# EAGLE schematic Rev 3 (EAGLE 9.6.2)
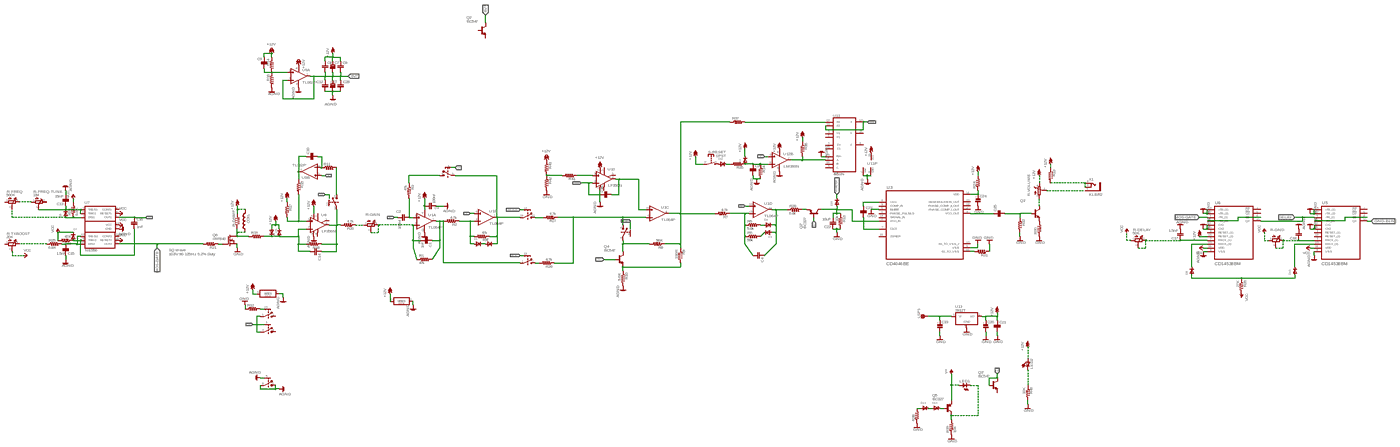
[diagram p0: schematic, sheet 1, overview]
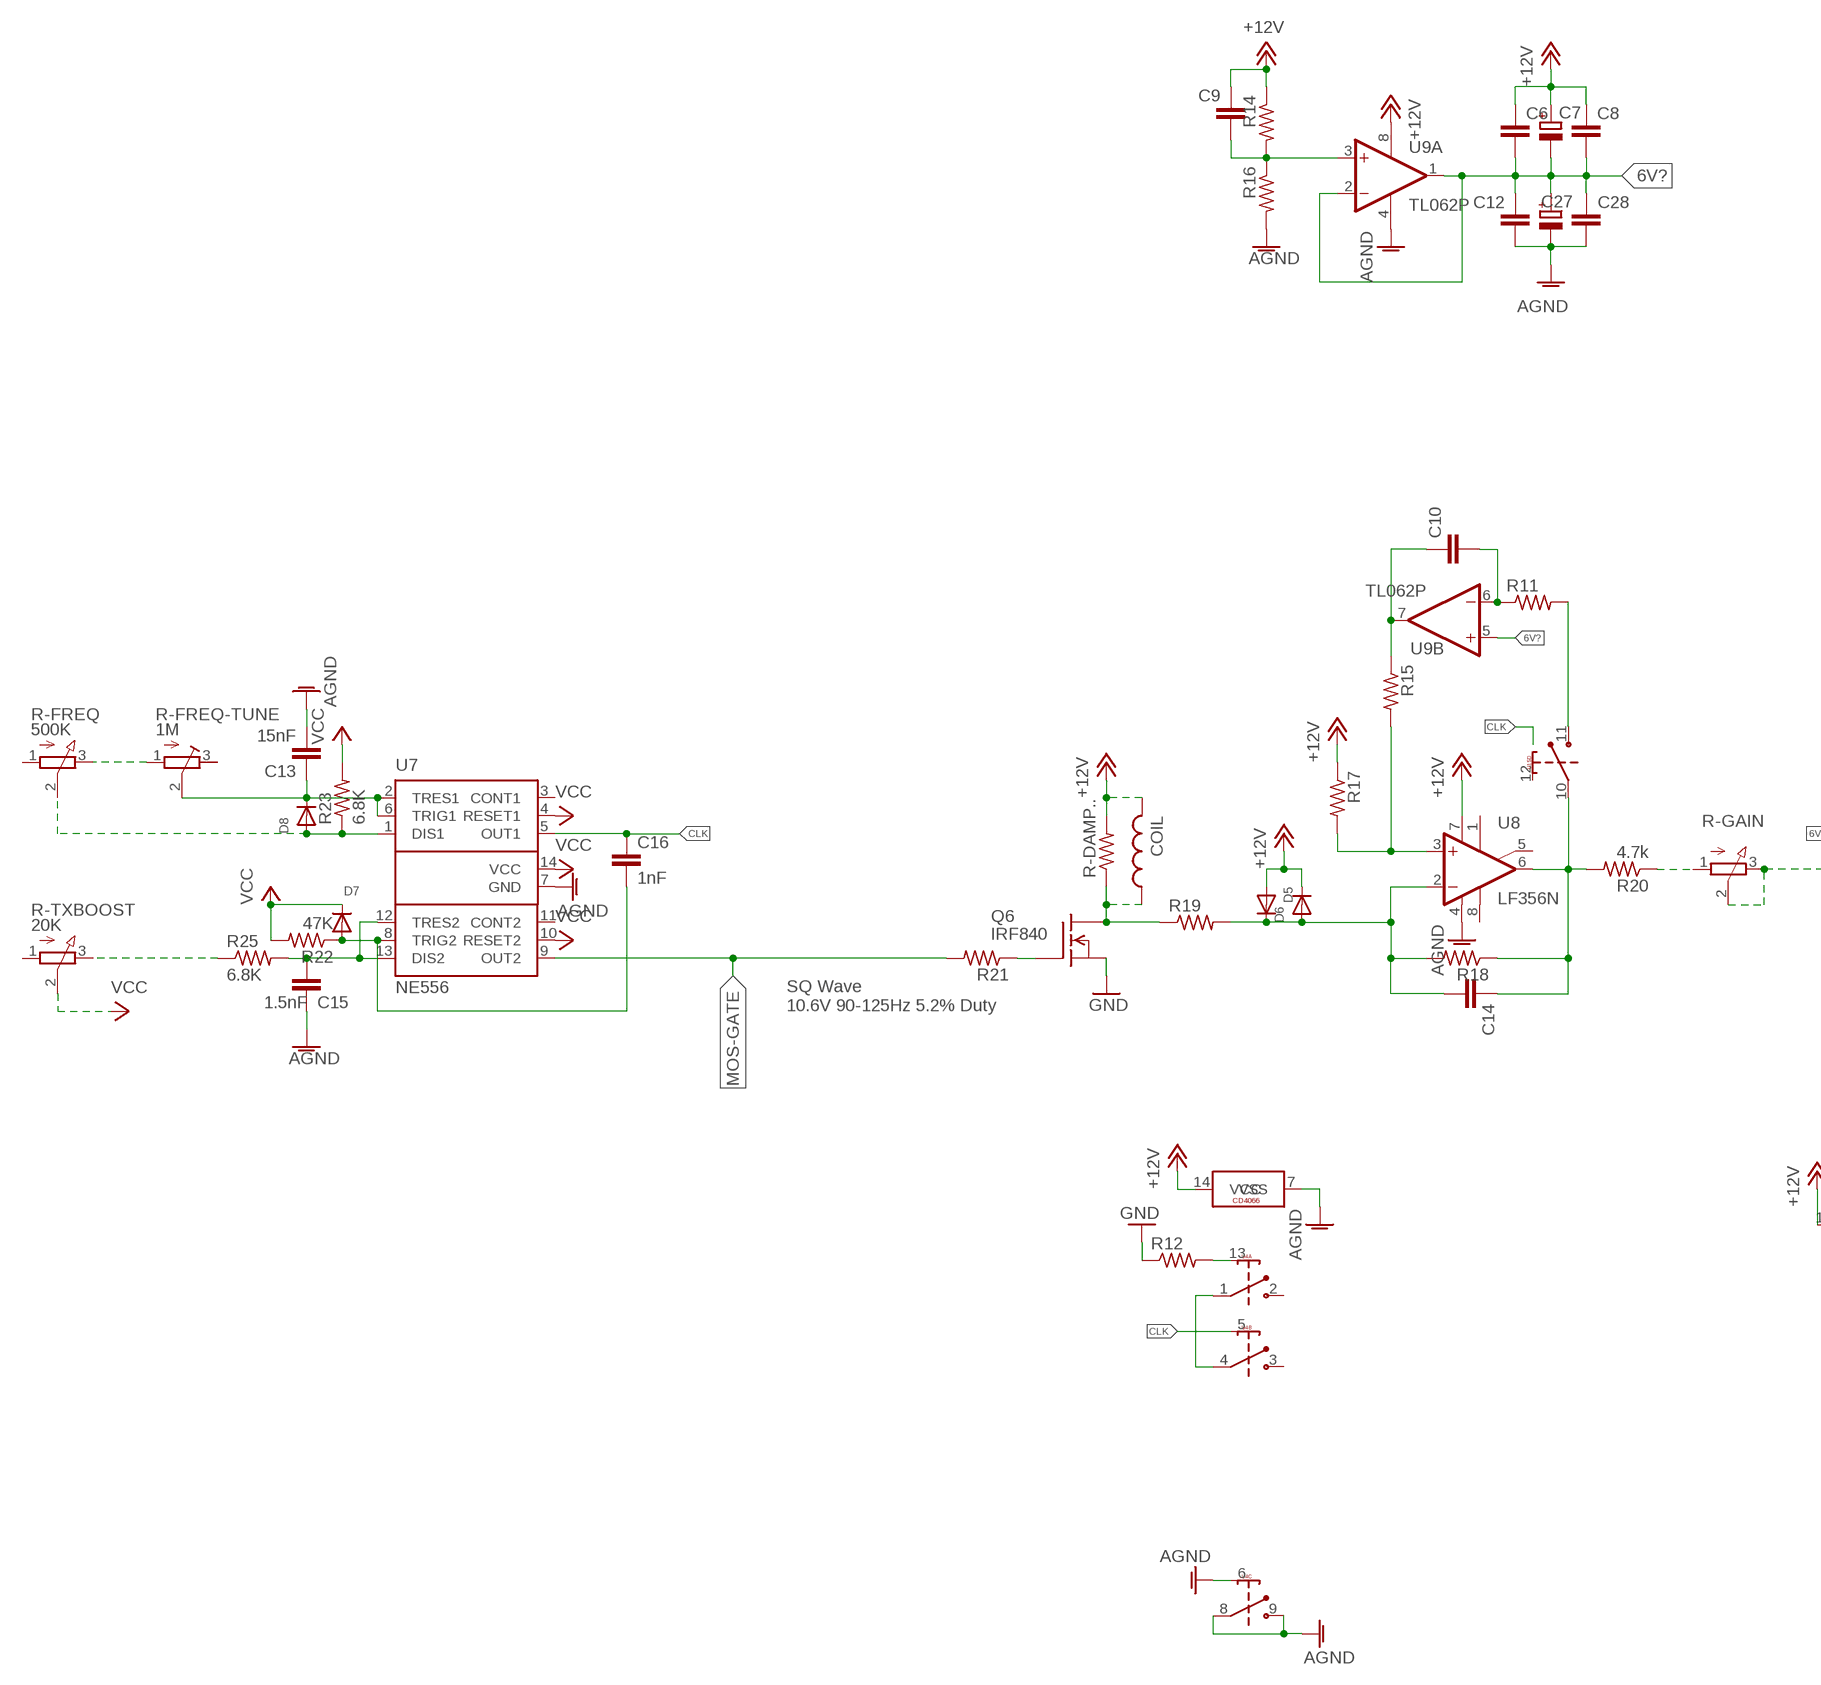
[diagram p1: schematic, sheet 1, part 1 of 4]
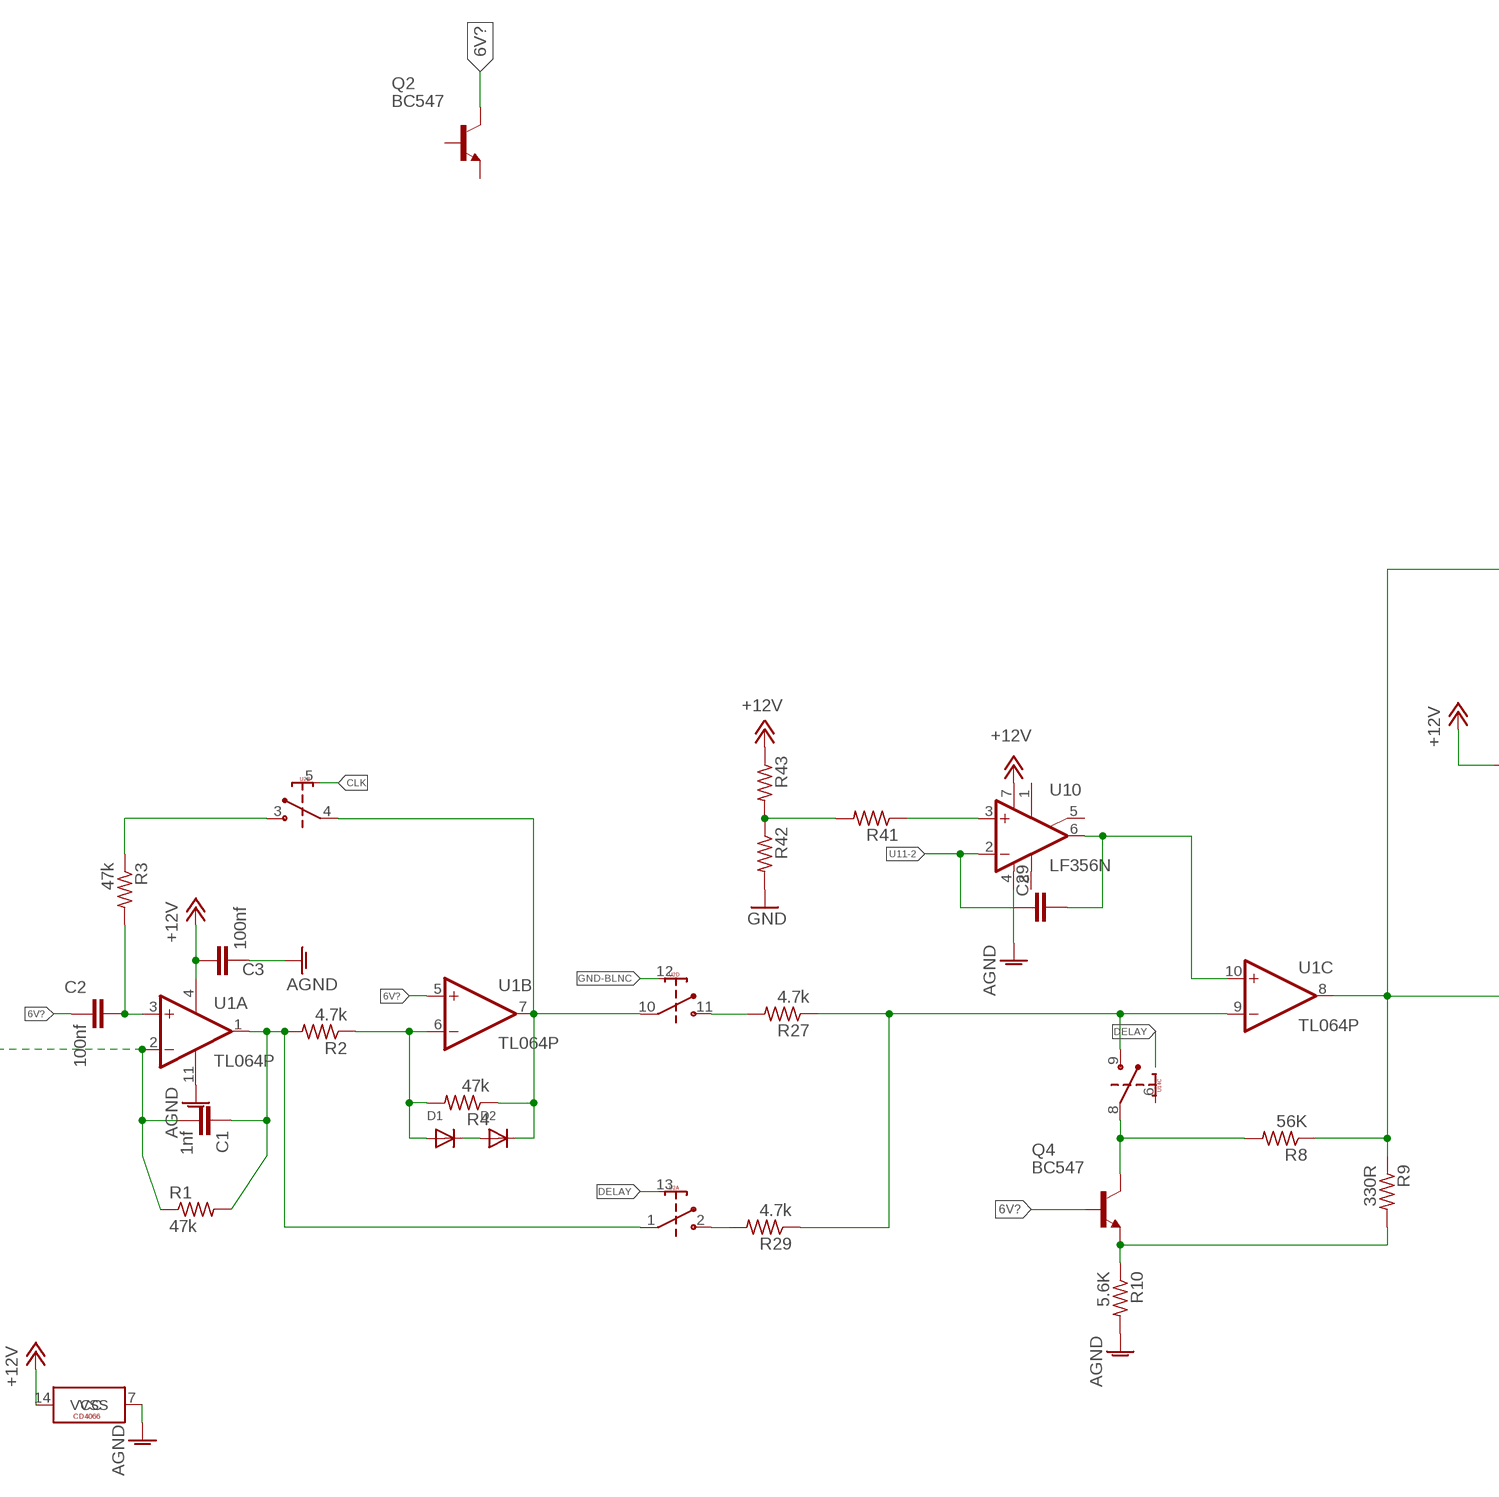
[diagram p2: schematic, sheet 1, part 2 of 4]
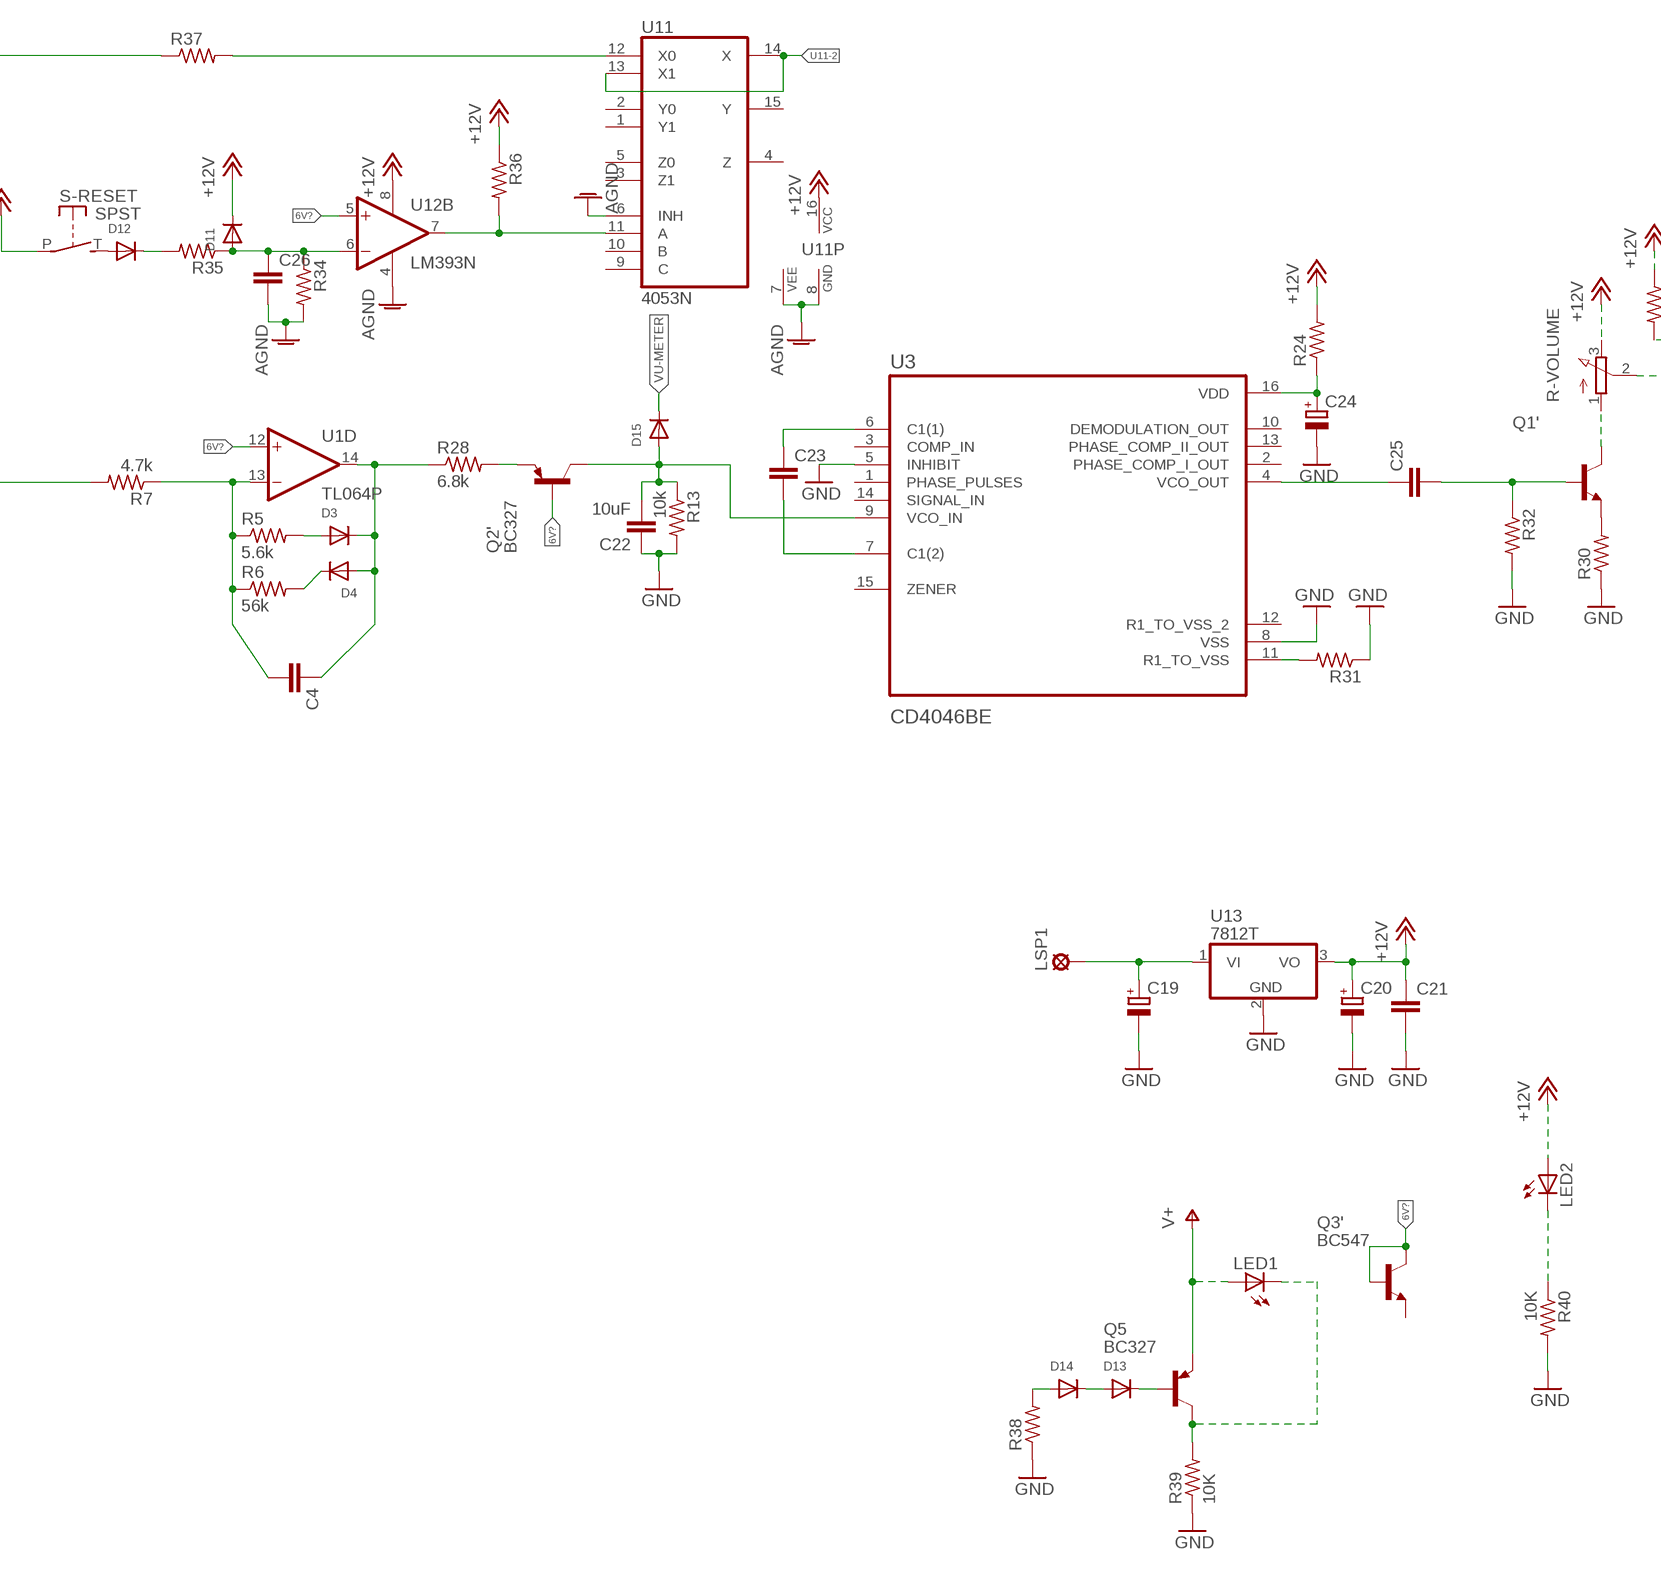
[diagram p3: schematic, sheet 1, part 3 of 4]
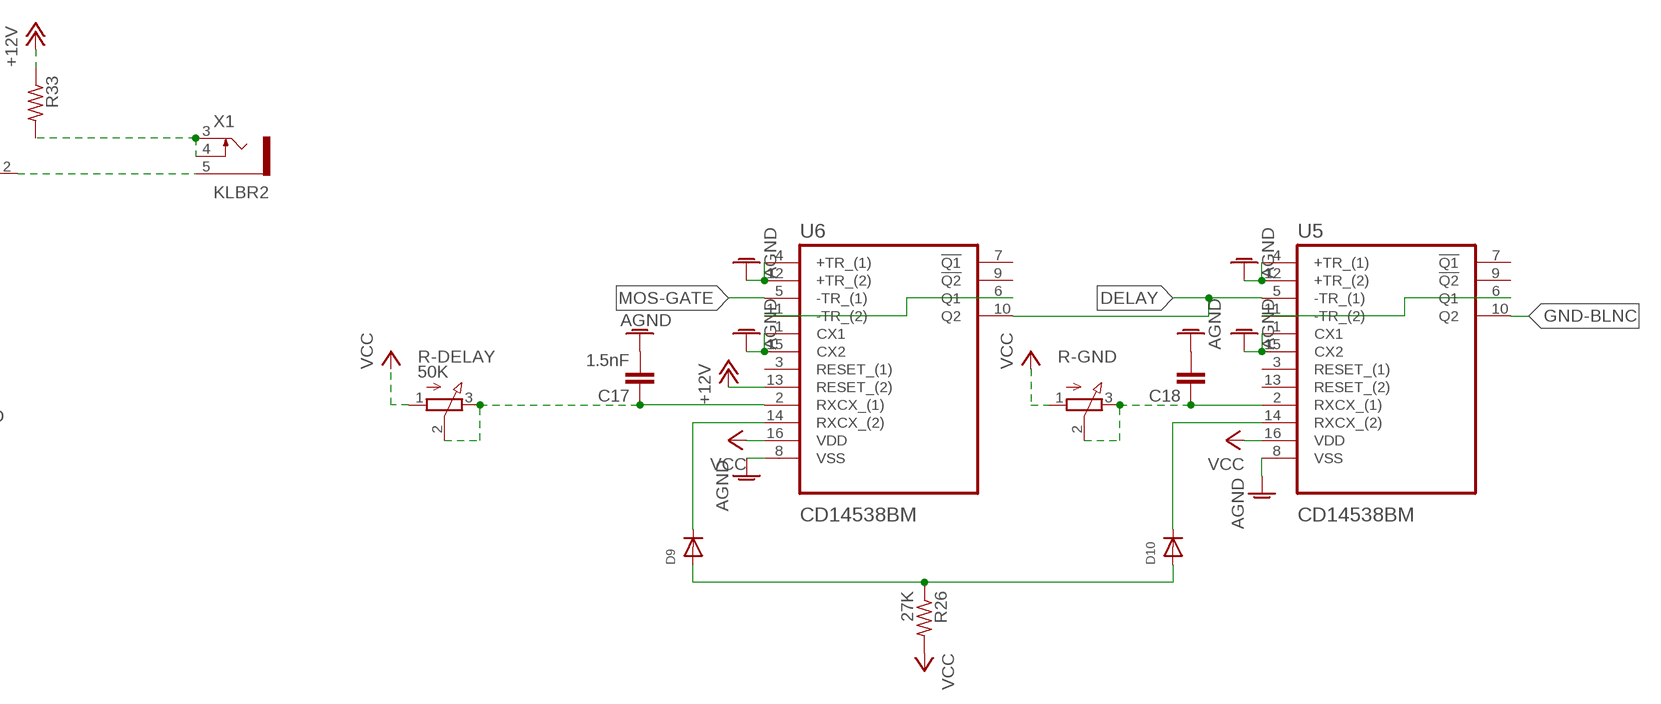
[diagram p4: schematic, sheet 1, part 4 of 4]

## Parts
C1  1nf  C-EU050-025X075  [C050-025X075]
C2  100nf  C-EU050-025X075  [C050-025X075]
C3  100nf  C-EU050-025X075  [C050-025X075]
C4  C-EU050-025X075  [C050-025X075]
C6  C-EU050-025X075  [C050-025X075]
C7  CPOL-EU140CLH-0810  [140CLH-0810]
C8  C-EU050-025X075  [C050-025X075]
C9  C-EU050-025X075  [C050-025X075]
C10  C-EU050-025X075  [C050-025X075]
C12  C-EU050-025X075  [C050-025X075]
C13  15nF  C-EU050-025X075  [C050-025X075]
C14  C-EU050-025X075  [C050-025X075]
C15  1.5nF  C-EU050-025X075  [C050-025X075]
C16  1nF  C-EU050-025X075  [C050-025X075]
C17  1.5nF  C-EU050-025X075  [C050-025X075]
C18  C-EU050-025X075  [C050-025X075]
C19  CPOL-EU140CLH-0810  [140CLH-0810]
C20  CPOL-EU140CLH-0810  [140CLH-0810]
C21  C-EU050-025X075  [C050-025X075]
C22  10uF  C-EU050-025X075  [C050-025X075]
C23  C-EU050-025X075  [C050-025X075]
C24  CPOL-EU140CLH-0810  [140CLH-0810]
C25  C-EU050-025X075  [C050-025X075]
C26  C-EU050-025X075  [C050-025X075]
C27  CPOL-EU140CLH-0810  [140CLH-0810]
C28  C-EU050-025X075  [C050-025X075]
C29  C-EU050-025X075  [C050-025X075]
COIL  L-USTJ4-U2  [TJ4-U2]
D1  DIODEDO-1N4148  [DO-1N4148]
D2  DIODEDO-1N4148  [DO-1N4148]
D3  DIODEDO-1N4148  [DO-1N4148]
D4  DIODEDO-1N4148  [DO-1N4148]
D5  DIODEDO-1N4148  [DO-1N4148]
D6  DIODEDO-1N4148  [DO-1N4148]
D7  DIODEDO-1N4148  [DO-1N4148]
D8  DIODEDO-1N4148  [DO-1N4148]
D9  DIODEDO-1N4148  [DO-1N4148]
D10  DIODEDO-1N4148  [DO-1N4148]
D11  DIODEDO-1N4148  [DO-1N4148]
D12  DIODEDO-1N4148  [DO-1N4148]
D13  DIODEDO-1N4148  [DO-1N4148]
D14  DIODEDO-1N4148  [DO-1N4148]
D15  DIODEDO-1N4148  [DO-1N4148]
LED1  LED5MM  [LED5MM]
LED2  LED5MM  [LED5MM]
LSP1  SE14  [SE14]
Q1'  MPSA14-NPN-TO92-EBC  [TO92-EBC]
Q2  BC547  [TO92]
Q2'  BC327  [TO92]
Q3'  BC547  [TO92]
Q4  BC547  [TO92]
Q5  BC327  [TO92]
Q6  IRF840  [TO220]
R1  47k  R-US_0207/7  [0207/7]
R2  4.7k  R-US_0207/7  [0207/7]
R3  47k  R-US_0207/7  [0207/7]
R4  47k  R-US_0207/7  [0207/7]
R5  5.6k  R-US_0207/7  [0207/7]
R6  56k  R-US_0207/7  [0207/7]
R7  4.7k  R-US_0207/7  [0207/7]
R8  56K  R-US_0207/7  [0207/7]
R9  330R  R-US_0207/7  [0207/7]
R10  5.6K  R-US_0207/7  [0207/7]
R11  R-US_0207/7  [0207/7]
R12  R-US_0207/7  [0207/7]
R13  10k  R-US_0207/7  [0207/7]
R14  R-US_0207/7  [0207/7]
R15  R-US_0207/7  [0207/7]
R16  R-US_0207/7  [0207/7]
R17  R-US_0207/7  [0207/7]
R18  R-US_0207/7  [0207/7]
R19  R-US_0207/7  [0207/7]
R20  4.7k  R-US_0207/7  [0207/7]
R21  R-US_0207/7  [0207/7]
R22  47K  R-US_0207/7  [0207/7]
R23  6.8K  R-US_0207/7  [0207/7]
R24  R-US_0207/7  [0207/7]
R25  6.8K  R-US_0207/7  [0207/7]
R26  27K  R-US_0207/7  [0207/7]
R27  4.7k  R-US_0207/7  [0207/7]
R28  6.8k  R-US_0207/7  [0207/7]
R29  4.7k  R-US_0207/7  [0207/7]
R30  R-US_0207/7  [0207/7]
R31  R-US_0207/7  [0207/7]
R32  R-US_0207/7  [0207/7]
R33  R-US_0207/7  [0207/7]
R34  R-US_0207/7  [0207/7]
R35  R-US_0207/7  [0207/7]
R36  R-US_0207/7  [0207/7]
R37  R-US_0207/7  [0207/7]
R38  R-US_0207/7  [0207/7]
R39  10K  R-US_0207/7  [0207/7]
R40  10K  R-US_0207/7  [0207/7]
R41  R-US_0207/7  [0207/7]
R42  R-US_0207/7  [0207/7]
R43  R-US_0207/7  [0207/7]
R-DAMP..  R-US_0207/7  [0207/7]
R-DELAY  50K  3RP/1610N  [3RP/1610N]
R-FREQ  500K  3RP/1610N  [3RP/1610N]
R-FREQ-TUNE  1M  R-TRIMM3296W  [RTRIM3296W]
R-GAIN  3RP/1610N  [3RP/1610N]
R-GND  3RP/1610N  [3RP/1610N]
R-TXBOOST  20K  3RP/1610N  [3RP/1610N]
R-VOLUME  3RP/1610N  [3RP/1610N]
S-RESET  SPST  [JUDCOSPST]
U1  TL064P  [DIL14]
U2  CD4066B  [DIP254P762X508-14]
U3  CD4046BE  [DIP794W45P254L1969H508Q16]
U4  CD4066B  [DIP254P762X508-14]
U5  CD14538BM  [SOIC127P600X175-16N]
U6  CD14538BM  [SOIC127P600X175-16N]
U7  NE556  [DIL14]
U8  LF356N  [DIL08]
U9  TL062P  [DIL08]
U10  LF356N  [DIL08]
U11  4053N  [DIL16]
U12  LM393N  [DIL08]
U13  7812T  [TO220H]
U14  CD4066B  [DIP254P762X508-14]
U15  CD4066B  [DIP254P762X508-14]
X1  KLBR2  [KLBR2]

## Nets
6V?: C2.2 C6.2 C7.- C8.2 C12.1 C27.+ C28.1 Q2'.2(B) Q2.3(C) Q3'.2(B) Q3'.3(C) Q4.2(B) U1.5(B:+IN) U1.12(D:+IN) U9.1(A:OUT) U9.2(A:-IN) U9.5(B:+IN) U12.5(B:+IN)
+12V: C3.1 C6.1 C7.+ C8.1 C9.1 C20.+ C21.1 COIL.2 D5.A D6.C D11.C LED2.A R14.1 R17.1 R24.2 R33.1 R36.1 R43.1 R-DAMP...2 R-VOLUME.3(E) S-RESET.P U1.4(P:V+) U2.14(P:VCC) U4.14(P:VCC) U6.13(RESET_(2)) U8.7(V+) U9.8(P:V+) U10.7(V+) U11.16(VCC) U12.8(P:V+) U13.3(VO)
AGND: C3.2 C12.2 C13.2 C15.2 C17.2 C18.2 C26.2 C27.- C28.2 R10.2 R16.2 R34.2 U1.11(P:V-) U2.7(P:VSS) U4.6(C:CTRL) U4.7(P:VSS) U4.8(C:IN) U4.9(C:OUT) U5.1(CX1) U5.4(+TR_(1)) U5.8(VSS) U5.12(+TR_(2)) U5.15(CX2) U6.1(CX1) U6.4(+TR_(1)) U6.8(VSS) U6.12(+TR_(2)) U6.15(CX2) U7.7(GND) U8.4(V-) U9.4(P:V-) U10.4(V-) U11.6(INH) U11.7(VEE) U11.8(GND) U12.4(P:V-)
CLK: C16.1 U2.5(B:CTRL) U4.5(B:CTRL) U7.5(OUT1)
DELAY: U2.13(A:CTRL) U5.5(-TR_(1)) U6.10(Q2)
GND: C19.- C20.- C21.2 C22.1 C24.- Q6.3(S) R12.1 R13.2 R30.1 R31.1 R32.2 R38.1 R39.1 R40.2 R42.2 U3.5(INHIBIT) U3.8(VSS) U13.2(GND)
GND-BLNC: U2.12(D:CTRL) U5.10(Q2)
MOS-GATE: R21.2 U6.5(-TR_(1)) U7.9(OUT2)
N$1: R20.1 R-GAIN.1(A)
N$2: C1.2 R1.1 R-GAIN.2(S) R-GAIN.3(E) U1.2(A:-IN)
N$3: D1.A R2.1 R4.2 U1.6(B:-IN)
N$4: C2.1 R3.2 U1.3(A:+IN)
N$5: U4.1(A:IN) U4.4(B:IN)
N$6: R12.2 U4.13(A:CTRL)
N$7: R27.2 U2.11(D:OUT)
N$8: D1.C D2.A
N$9: R29.2 U2.2(A:OUT)
N$10: C4.2 R5.1 R6.1 R7.1 U1.13(D:-IN)
N$11: C4.1 D3.C D4.A R28.1 U1.14(D:OUT)
N$12: C16.2 D7.A R22.1 U7.8(TRIG2)
N$13: R11.2 U15.11(D:OUT)
N$14: C22.2 D15.A Q2'.3(C) R13.1 U3.9(VCO_IN)
N$15: D3.A R5.2
N$16: D4.C R6.2
N$17: Q4.1(E) R9.2 R10.1
N$18: R7.2 R8.1 R9.1 R37.1 U1.8(C:OUT)
N$19: C25.1 U3.4(VCO_OUT)
N$20: D9.C U6.14(RXCX_(2))
N$21: C10.2 R11.1 U9.6(B:-IN)
N$22: C29.2 U1.10(C:+IN) U10.6(OUT)
N$23: C10.1 R15.1 U9.7(B:OUT)
N$24: C14.2 D5.C D6.A R18.2 R19.2 U8.2(-IN)
N$25: COIL.1 Q6.2(D) R19.1 R-DAMP...1
N$26: C23.1 U3.6(C1(1))
N$27: C23.2 U3.7(C1(2))
N$28: C24.+ R24.1 U3.16(VDD)
N$29: R15.2 R17.2 U8.3(+IN)
N$30: Q1'.E R30.2
N$31: Q6.1(G) R21.1
N$32: R25.1 R-TXBOOST.3(E)
N$33: R33.2 X1.3 X1.4
N$34: D8.A R23.1 R-FREQ.2(S) U7.1(DIS1)
N$35: C13.1 D8.C R-FREQ-TUNE.2(S) U7.2(TRES1) U7.6(TRIG1)
N$36: C15.1 R25.2 U7.12(TRES2) U7.13(DIS2)
N$37: Q1'.C R-VOLUME.1(A)
N$38: D10.C U5.14(RXCX_(2))
N$39: U6.6(Q1) U6.11(-TR_(2))
N$40: U5.6(Q1) U5.11(-TR_(2))
N$41: C18.1 R-GND.2(S) R-GND.3(E) U5.2(RXCX_(1))
N$42: D9.A D10.A R26.1
N$43: Q2'.1(E) R28.2
N$44: R31.2 U3.11(R1_TO_VSS)
N$45: C25.2 Q1'.B R32.1
N$46: C19.+ LSP1.MP U13.1(VI)
N$47: R-FREQ-TUNE.1(A) R-FREQ.3(E)
N$48: R-VOLUME.2(S) X1.5
N$49: C17.1 R-DELAY.2(S) R-DELAY.3(E) U6.2(RXCX_(1))
N$50: D12.C R35.2
N$51: C26.1 D11.A R34.1 R35.1 U12.6(B:-IN)
N$52: R36.2 U11.11(A) U12.7(B:OUT)
N$53: D12.A S-RESET.T(S)
N$54: R41.1 U10.3(+IN)
N$55: R37.2 U11.12(X0)
N$56: D13.A D14.C
N$57: D13.C Q5.2(B)
N$58: D14.A R38.2
N$59: LED1.K(C) Q5.3(C) R39.2
N$60: LED2.K(C) R40.1
N$61: R3.1 U2.3(B:OUT)
N$62: R41.2 R42.1 R43.2
N$64: C9.2 R14.2 R16.1 U9.3(A:+IN)
U2-1: C1.1 R1.2 R2.2 U1.1(A:OUT) U2.1(A:IN)
U2-9: C14.1 R18.1 R20.2 U8.6(OUT) U15.10(D:IN)
U2-10: D2.C R4.1 U1.7(B:OUT) U2.4(B:IN) U2.10(D:IN)
U4-10: R27.1 R29.1 U1.9(C:-IN) U14.9(C:OUT)
U4-11: Q4.3(C) R8.2 U14.8(C:IN)
U11-2: C29.1 U10.2(-IN) U11.13(X1) U11.14(X)
V+: LED1.A Q5.1(E)
VCC: D7.C R22.2 R23.2 R26.2 R-DELAY.1(A) R-GND.1(A) R-TXBOOST.2(S) U5.16(VDD) U6.16(VDD) U7.4(RESET1) U7.10(RESET2) U7.14(VCC)
VU-METER: D15.C
Unconnected: Q2.1(E) Q2.2(B) Q3'.1(E) R-FREQ-TUNE.3(E) R-FREQ.1(A) R-TXBOOST.1(A) U2.6(C:CTRL) U2.8(C:IN) U2.9(C:OUT) U3.1(PHASE_PULSES) U3.2(PHASE_COMP_I_OUT) U3.3(COMP_IN) U3.10(DEMODULATION_OUT) U3.13(PHASE_COMP_II_OUT) U3.14(SIGNAL_IN) U3.15(ZENER) U4.2(A:OUT) U4.3(B:OUT) U4.10(D:IN) U4.11(D:OUT) U4.12(D:CTRL) U5.3(RESET_(1)) U5.7(!Q1) U5.9(!Q2) U5.13(RESET_(2)) U6.3(RESET_(1)) U6.7(!Q1) U6.9(!Q2) U7.3(CONT1) U7.11(CONT2) U8.1(ON1) U8.5(ON2) U8.8(OPT) U10.1(ON1) U10.5(ON2) U10.8(OPT) U11.1(Y1) U11.2(Y0) U11.3(Z1) U11.4(Z) U11.5(Z0) U11.9(C) U11.10(B) U11.15(Y) U12.1(A:OUT) U12.2(A:-IN) U12.3(A:+IN) U14.1(A:IN) U14.2(A:OUT) U14.3(B:OUT) U14.4(B:IN) U14.5(B:CTRL) U14.6(C:CTRL) U14.7(P:VSS) U14.10(D:IN) U14.11(D:OUT) U14.12(D:CTRL) U14.13(A:CTRL) U14.14(P:VCC) U15.1(A:IN) U15.2(A:OUT) U15.3(B:OUT) U15.4(B:IN) U15.5(B:CTRL) U15.6(C:CTRL) U15.7(P:VSS) U15.8(C:IN) U15.9(C:OUT) U15.12(D:CTRL) U15.13(A:CTRL) U15.14(P:VCC)

## Notes on the sheet
- SQ Wave
  10.6V 90-125Hz 5.2% Duty

## Power pins joined to a net without a drawn wire
R1_TO_VSS_2: U3.12(R1_TO_VSS_2)

## Library data of the parts
C1-C4 C6 C8-C10 C12-C18 C21-C23 C25 C26 C28 C29 = rcl:C-EU: CAPACITOR, European symbol
C7 C19 C20 C24 C27 = rcl:CPOL-EU: POLARIZED CAPACITOR, European symbol
COIL = rcl:L-US: INDUCTOR, American symbol
D1-D15 = adafruit:DIODE: Diode SMADIODE - SMA Surface Mount Package 20V 1A Schottky Diode Digikey: 641-1014-6-ND DO-1N4148 - Through Hole Small Current Diode SOD-123 20V 1 A (.5mV Vf) Schottky Diode - Digikey: MBRX120TPMSCT-ND SOD-323 10V 570mA (.38mV Vf, 3ns) Schottky Diode - Digikey: ZLLS410CT-ND SOD-523 30V 30mA Schottky Diode (RB751S-40TE61) - Digikey: RB751S-40TE61CT-ND SOT23-R/W - SOT23 Package (R = Solder Paste/Reflow Ovens, W = Hand-Soldering) BAT54Film 40V 300mA - Digikey: 497-7162-1-ND
LED1 LED2 = adafruit:LED: LED OSRAM: - CHIPLED LG R971, LG N971, LY N971, LG Q971, LY Q971, LO R971, LY R971 LH N974, LH R974 LS Q976, LO Q976, LY Q976 LO Q996 - Hyper CHIPLED LW Q18S LB Q993, LB Q99A, LB R99A - SideLED LS A670, LO A670, LY A670, LG A670, LP A670 LB A673, LV A673, LT A673, LW A673 LH A674 LY A675 LS A676, LA A676, LO A676, LY A676, LW A676 LS A679, LY A679, LG A679 - Hyper Micro SIDELED® LS Y876, LA Y876, LO Y876, LY Y876 LT Y87S - SmartLED LW L88C, LW L88S LB L89C, LB L89S, LG L890 LS L89K, LO L89K, LY L89K LS L896, LA L896, LO L896, LY L896 - TOPLED LS T670, LO T670, LY T670, LG T670, LP T670 LSG T670, LSP T670, LSY T670, LOP T670, LYG T670 LG T671, LOG T671, LSG T671 LB T673, LV T673, LT T673, LW T673 LH T674 LS T676, LA T676, LO T676, LY T676, LB T676, LH T676, LSB T676, LW T676 LB T67C, LV T67C, LT T67C, LS T67K, LO T67K, LY T67K, LW E67C LS E67B, LA E67B, LO E67B, LY E67B, LB E67C, LV E67C, LT E67C LW T67C LS T679, LY T679, LG T679 LS T770, LO T770, LY T770, LG T770, LP T770 LB T773, LV T773, LT T773, LW T773 LH T774 LS E675, LA E675, LY E675, LS T675 LS T776, LA T776, LO T776, LY T776, LB T776 LHGB T686 LT T68C, LB T68C - Hyper Mini TOPLED® LB M676 - Mini TOPLED Santana® LG M470 LS M47K, LO M47K, LY M47K Source: http://www.osram.convergy.de/
LSP1 = solpad:SE14: SOLDER PAD E1553, drill 1,4mm, distributor Buerklin, 07F820
Q1' = transistor:*-NPN-: NPN Transistror BF959 corrected 2008.03.06
Q2 Q3' Q4 = transistor-npn:BC547*: NPN Transistor
Q2' Q5 = transistor-pnp:BC327: PNP Transistor
Q6 = transistor-fet:IRF840: N-Channel Enhancement MOSFET (HEXFET); 500V; 8A; 0,85Ohm
R1-R43 R-DAMP.. = rcl:R-US_: RESISTOR, American symbol
R-DELAY R-FREQ R-GAIN R-GND R-TXBOOST R-VOLUME = pot:3RP/1610N: 16mm Potentiometer one level Source: http://www.alphapotentiometers.net/html/16mm_pot_2.html
R-FREQ-TUNE = rcl:R-TRIMM: Trimm resistor
S-RESET = adafruit:SPST: Judco 50-0015-00
U1 = linear:TL064: OP AMP
U2 U4 U14 U15 = CD4066BCN:CD4066B
U3 = CD4046BE:CD4046BE: Check prices <https://pricing.snapeda.com/parts/CD4046BE/Texas%20Instruments/view-part?ref=eda>; AVAILABILITY: Warning; DESCRIPTION: CMOS Micropower Phase-Locked Loop 16-PDIP -55 to 125; MF: Texas Instruments; MP: CD4046BE; PACKAGE: PDIP-16 Texas Instruments; PRICE: None; PURCHASE-URL: https://pricing.snapeda.com/search/part/CD4046BE/?ref=eda
U5 U6 = CD14538BM:CD14538BM: Check prices <https://pricing.snapeda.com/parts/CD14538BM/Texas%20Instruments/view-part?ref=eda>; AVAILABILITY: Warning; DESCRIPTION: CMOS Dual Precision Monostable Multivibrator (125 C Operation) 16-SOIC -55 to 125; MF: Texas Instruments; MP: CD14538BM; PACKAGE: SOIC-16 Texas Instruments; PRICE: None; PURCHASE-URL: https://pricing.snapeda.com/search/part/CD14538BM/?ref=eda
U7 = st-microelectronics:NE556: General Purpose Biopolartimer; MPN: NE556; OC_FARNELL: 2349784; OC_NEWARK: 83C0108
U8 U10 = linear:LF356: OP AMP
U9 = linear:TL062: OP AMP
U11 = 40xx:4053: Triple 2-channel ANALOG MULTIPLEXER
U12 = linear:LM393: COMPARATOR
U13 = adafruit:78*: Positive VOLTAGE REGULATOR Added bigger pads to the TO-92 package
X1 = con-lumberg:KLBR?: Jack connectors according to JISC 6560, 2.5mm / 3.5 mm Klinkensteckverbinder nach JISC 6560, 2.5mm / 3,5 mm Source: http://www.lumberg.com/Produkte/PDFs/KLBR2.pdf www.lumberg.com/Produkte/PDFs/KLBR1.pdf; OC_FARNELL: unknown; OC_NEWARK: unknown